# EAGLE design chamberbiasa (EAGLE 7.6.0)
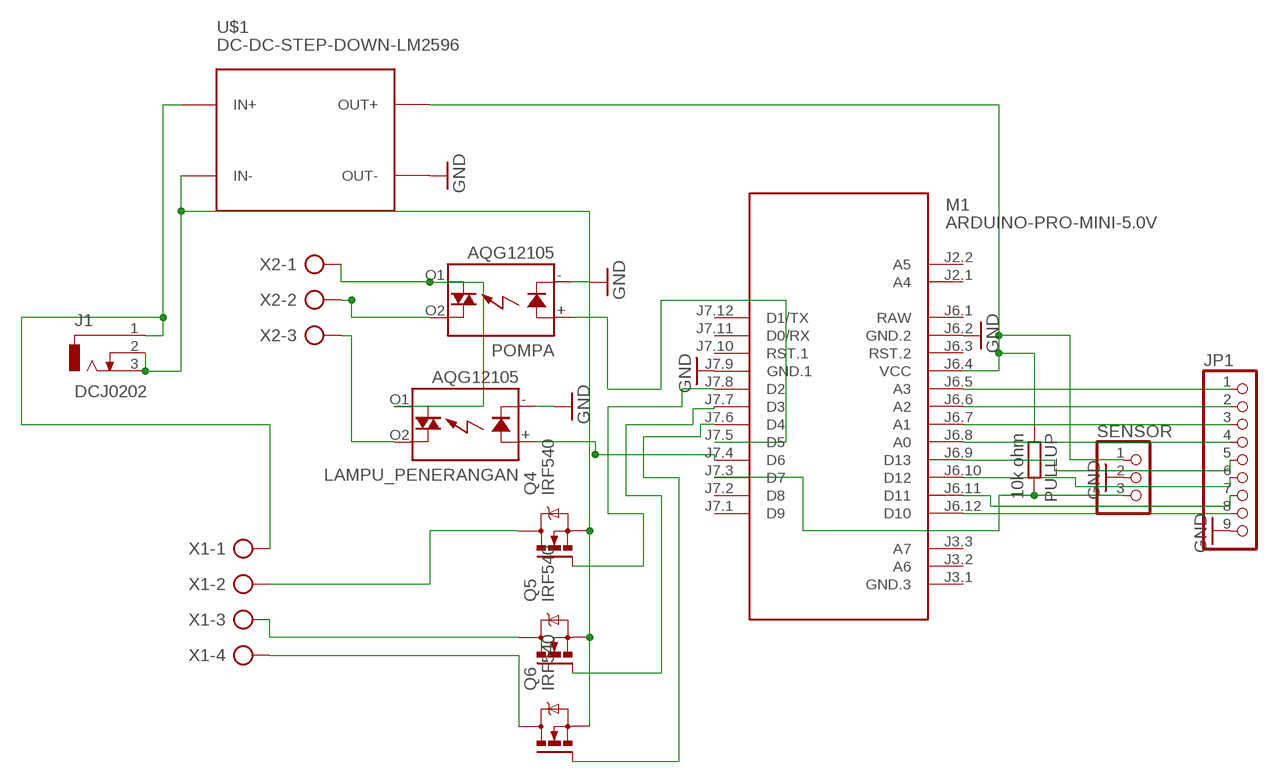
[diagram p0: schematic, sheet 1]

## Parts
J1  DCJ0202  [DCJ0202]
JP1  PINHD-1X9  [1X09]
LAMPU_PENERANGAN  AQG12105  [AQG]
M1  ARDUINO-PRO-MINI-5.0V  [ARDUINO-PRO-MINI]
POMPA  AQG12105  [AQG]
PULLUP  10k ohm  R-EU_0204/7  [0204/7]
Q4  IRF540  [TO220BV]
Q5  IRF540  [TO220BV]
Q6  IRF540  [TO220BV]
SENSOR  PINHD-1X3  [1X03]
U$1  DC-DC-STEP-DOWN-LM2596  [DC-DC-STEP-DOWN-LM2596]
X1  AK300/4  [AK300/4]
X2  AK300/3  [AK300/3]

## Nets
5V: M1.J6.4(VCC) PULLUP.1 SENSOR.1 U$1.OUT+
-12V: J1.2 J1.3 Q4.S Q5.S Q6.S U$1.IN-
GND: JP1.9 LAMPU_PENERANGAN.-(K) M1.J6.2(GND.2) M1.J7.9(GND.1) POMPA.-(K) SENSOR.2 U$1.OUT-
N$1: LAMPU_PENERANGAN.+(A) M1.J7.4(D6)
N$2: M1.J7.8(D2) Q4.G
N$3: M1.J7.5(D5) POMPA.+(A)
N$4: M1.J7.7(D3) Q5.G
N$5: M1.J7.6(D4) Q6.G
N$6: Q4.D X1.2
N$7: Q5.D X1.3
N$8: Q6.D X1.4
N$10: J1.1 U$1.IN+ X1.1
N$11: POMPA.O2(DS1) X2.2
N$12: LAMPU_PENERANGAN.O1(DS2) POMPA.O1(DS2) X2.1
N$13: LAMPU_PENERANGAN.O2(DS1) X2.3
N$14: JP1.1 M1.J6.5(A3)
N$15: M1.J7.3(D7) PULLUP.2 SENSOR.3
N$16: JP1.2 M1.J6.6(A2)
N$17: JP1.3 M1.J6.7(A1)
N$18: JP1.4 M1.J6.8(A0)
N$19: JP1.5 M1.J6.9(D13)
N$20: JP1.6 M1.J6.10(D12)
N$21: JP1.7 M1.J6.11(D11)
N$22: JP1.8 M1.J6.12(D10)
Unconnected: M1.J2.1(A4) M1.J2.2(A5) M1.J3.1(GND.3) M1.J3.2(A6) M1.J3.3(A7) M1.J6.3(RST.2) M1.J7.1(D9) M1.J7.2(D8) M1.J7.10(RST.1) M1.J7.11(D0/RX) M1.J7.12(D1/TX)

## Power pins joined to a net without a drawn wire
RAW: M1.J6.1(RAW)

## Library data of the parts
J1 = con-jack:DCJ0202: DC POWER JACK Source: DCJ0202.pdf; OC_FARNELL: unknown; OC_NEWARK: unknown
JP1 = pinhead:PINHD-1X9: PIN HEADER
LAMPU_PENERANGAN POMPA = relay:AQG*: SOLID STATE RELAY NAiS Zero-cross, Non zero-cross Source: http://www.mew-europe.com/.. en_ds_61611_0000.pdf; MF: AROMAT/ MATSUSHITA; MPN: AQG12105; OC_FARNELL: unknown; OC_NEWARK: 20J4759
M1 = diy-modules:ARDUINO-PRO-MINI-*: Arduino Pro Mini and compatible devices More details available here: https://www.arduino.cc/en/Main/ArduinoBoardProMini Click here to find device on ebay.com <http://www.ebay.com/sch/arduino+pro+mini>
PULLUP = rcl:R-EU_: RESISTOR, European symbol
Q4-Q6 = transistor-power:IRF540: HEXFET Power MOSFET
SENSOR = pinhead:PINHD-1X3: PIN HEADER
U$1 = diy-modules:DC-DC-STEP-DOWN-LM2596: DC/DC Step-Down Regulator based on LM2596-ADJ chip LM2596 datasheet available here: http://www.ti.com/lit/ds/symlink/lm2596.pdf Click here to find device on ebay.com <http://www.ebay.com/sch/lm2596+power+regulator>
X1 = con-ptr500:AK300/4: CONNECTOR; OC_FARNELL: unknown; OC_NEWARK: unknown
X2 = con-ptr500:AK300/3: CONNECTOR; OC_FARNELL: unknown; OC_NEWARK: unknown

## Board
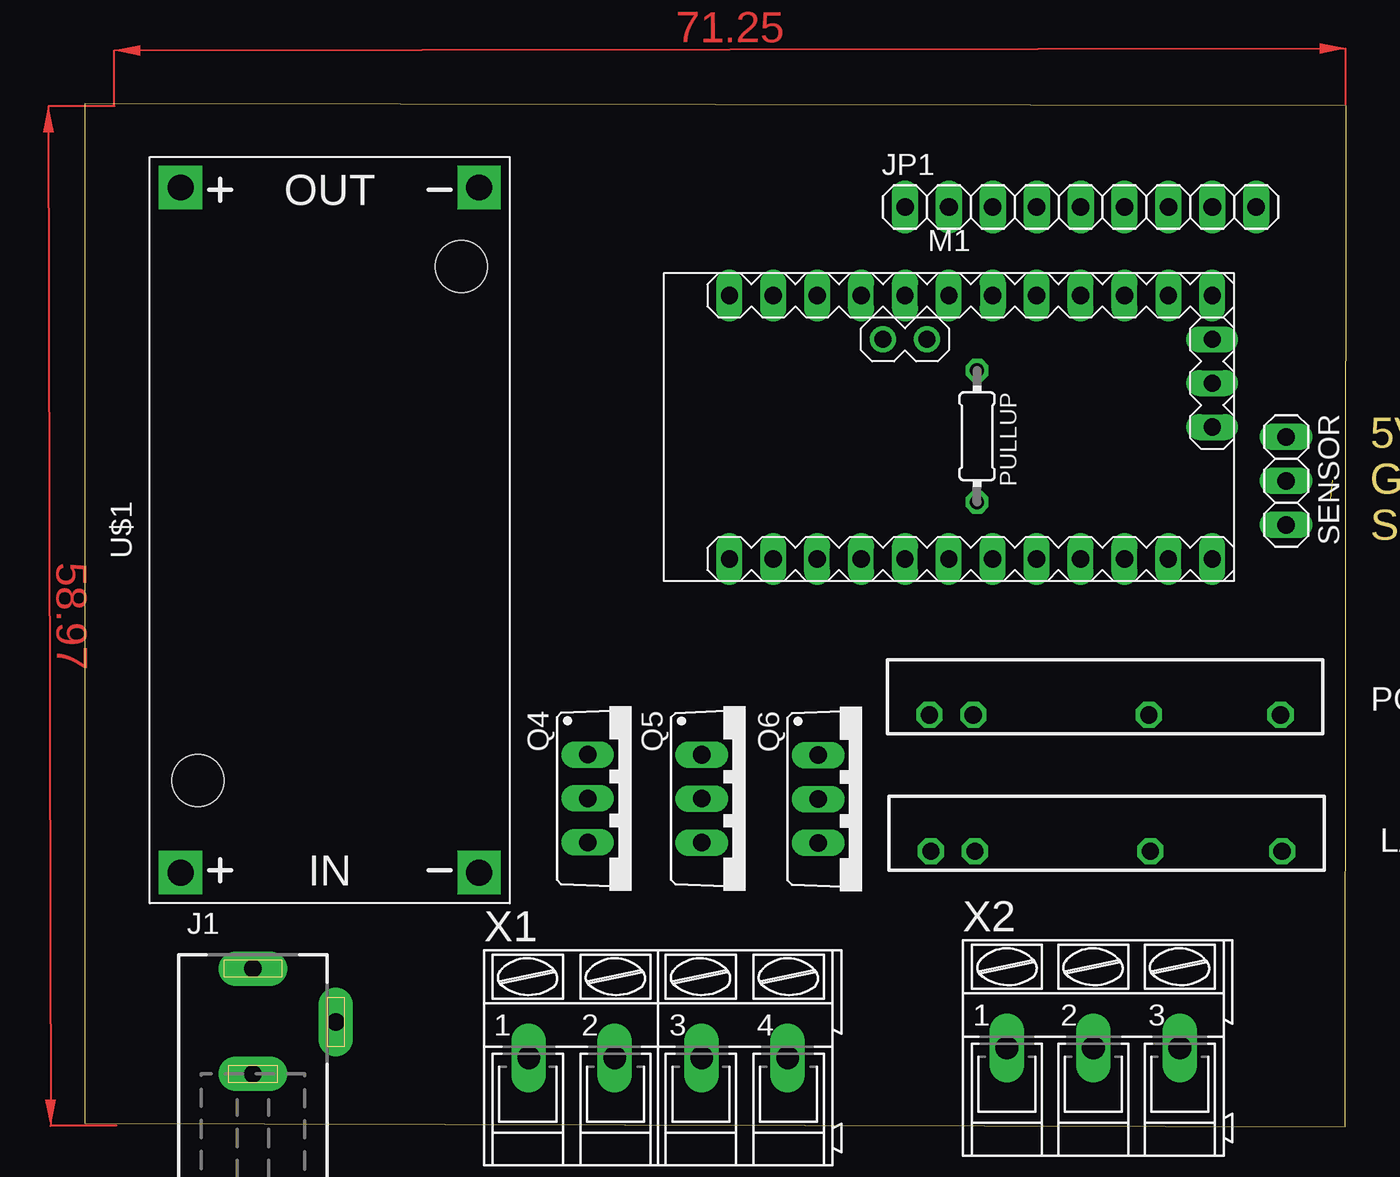
[diagram p1: board, top side]
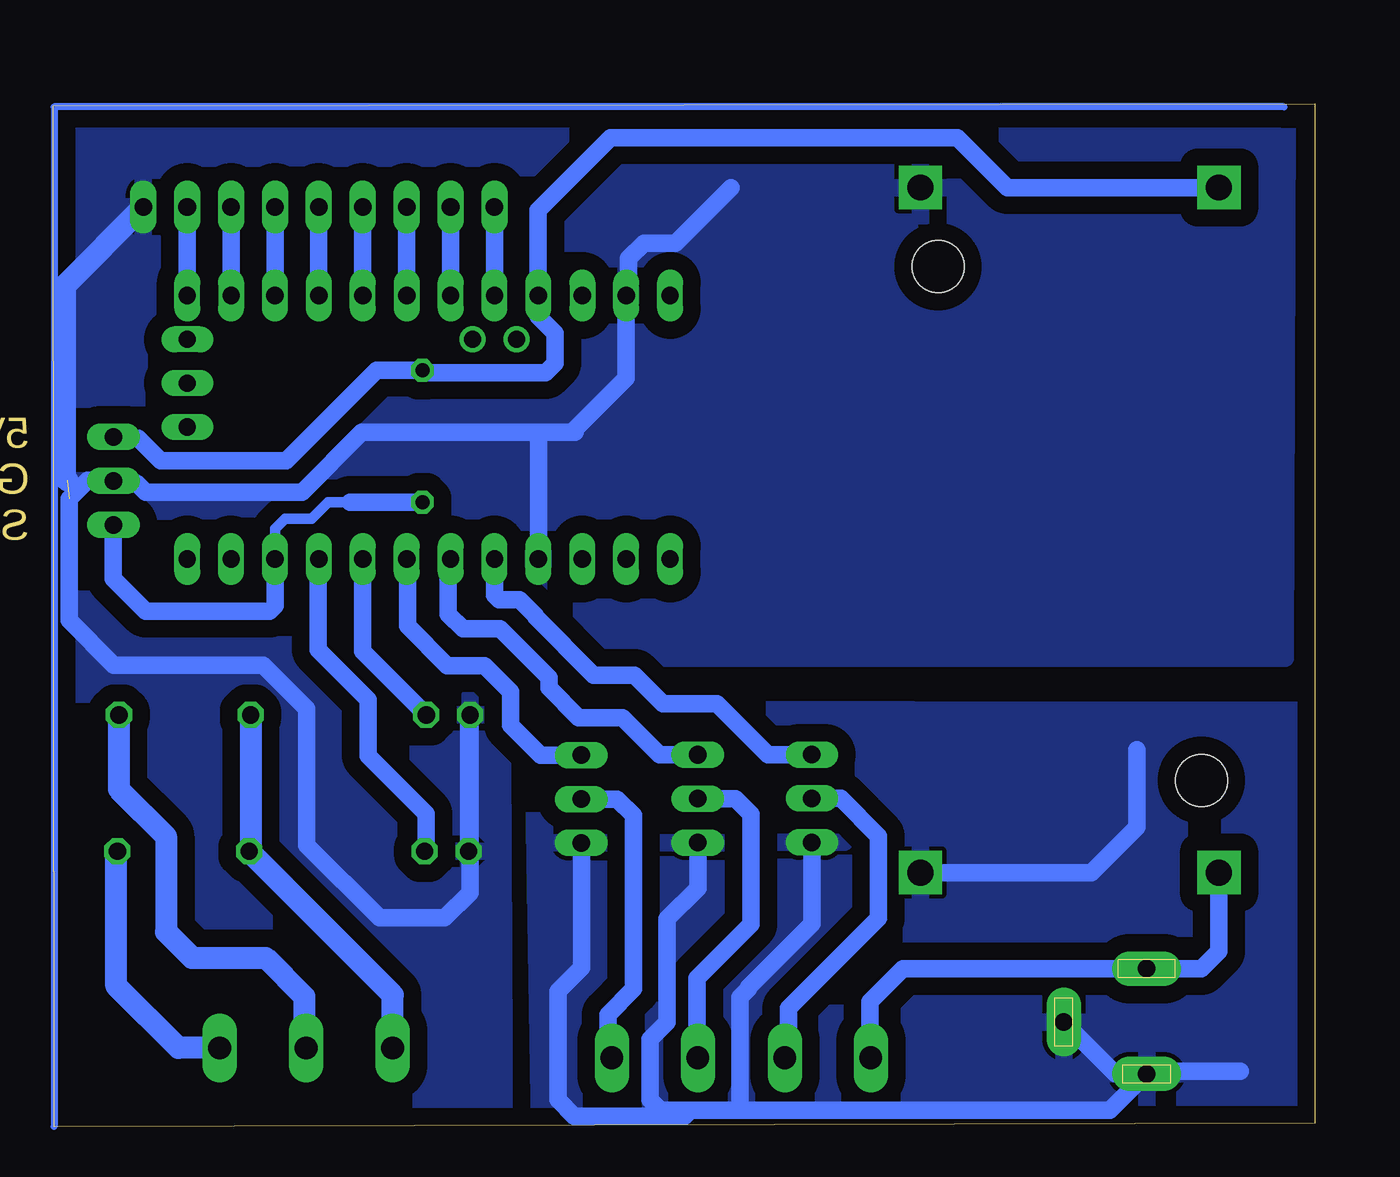
[diagram p2: board, bottom side, seen from below]

Size 72.98 x 59.19 mm. Coordinates in mm from the lower left corner, seen from the top.
Outline: 0,0.21 72.93,0 72.98,59.06 0,59.19 0,0.21
Copper layers (1*16): Top 0.035mm / dielectric 1.5mm / Bottom 0.035mm
Design rules "default": minimum track width 10mil, minimum drill 24mil, track to track 8mil, track to pad 8mil, pad to pad 8mil, via to via 8mil, smd to smd 8mil, copper to edge 40mil, drill to drill 8mil, minimum pad ring 10mil, minimum via ring 8mil, stop-mask expansion 4mil, vias tented up to drill 0mil, thermal gap 10mil

### Footprints (pad centres in the part's own frame; a part is rotated, then mirrored left to right if it is on the bottom)
DCJ0202 = drill 1 pad 2 long: 1 0,3.1; 2 4.8,0; 3 0,-3
1X09 = drill 1.016 long: 1 -10.16,0; 2 -7.62,0; 3 -5.08,0; 4 -2.54,0; 5 0,0; 6 2.54,0; 7 5.08,0; 8 7.62,0; 9 10.16,0
AQG = drill 1 octagon: + -7.62,0; - -10.16,0; O1 2.54,0; O2 10.16,0
ARDUINO-PRO-MINI = drill 1: J2.1 -1.27,5.08; J2.2 -3.81,5.08 | drill 1 long: J3.1 15.24,0; J3.2 15.24,2.54; J3.3 15.24,5.08; J6.1 -12.7,7.62; J6.2 -10.16,7.62; J6.3 -7.62,7.62; J6.4 -5.08,7.62; J6.5 -2.54,7.62; J6.6 0,7.62; J6.7 2.54,7.62; J6.8 5.08,7.62; J6.9 7.62,7.62; J6.10 10.16,7.62; J6.11 12.7,7.62; J6.12 15.24,7.62; J7.1 15.24,-7.62; J7.2 12.7,-7.62; J7.3 10.16,-7.62; J7.4 7.62,-7.62; J7.5 5.08,-7.62; J7.6 2.54,-7.62; J7.7 0,-7.62; J7.8 -2.54,-7.62; J7.9 -5.08,-7.62; J7.10 -7.62,-7.62; J7.11 -10.16,-7.62; J7.12 -12.7,-7.62
0204/7 = drill 0.813 octagon: 1 -3.81,0; 2 3.81,0
TO220BV = drill 1.016 long: D 0,-2.54; G -2.54,-2.54; S 2.54,-2.54
1X03 = drill 1.016 long: 1 -2.54,0; 2 0,0; 3 2.54,0
DC-DC-STEP-DOWN-LM2596 = drill 1.5 pad 2.5 square: IN+ -19.812,8.636; IN- -19.812,-8.636; OUT+ 19.812,8.636; OUT- 19.812,-8.636 | hole 3: -14.478,7.62; 15.24,-7.62
AK300/4 = drill 1.321 long: 1 -7.493,0; 2 -2.515,0; 3 2.515,0; 4 7.493,0
AK300/3 = drill 1.321 long: 1 -5.004,0; 2 0,0; 3 5.004,0

### Placement (x,y rotation side)
J1  9.72,6.06 0 top
JP1  57.62,53.2 0 top
LAMPU_PENERANGAN  59.11,15.93 0 top
M1  49.99,40.47 0 top
POMPA  59.02,23.83 0 top
PULLUP  51.62,39.94 270 top
Q4  31.63,18.99 270 top
Q5  38.23,18.98 270 top
Q6  44.97,18.96 270 top
SENSOR  69.5,37.36 270 top
U$1  14.17,34.52 90 top
X1  33.17,3.99 0 top
X2  58.35,4.56 0 top

### Tracks (layer width: path | path; a pad name or v marks a point on that pad's centre or on a via)
5V
  Bottom 1.016: U$1.OUT+ 17.77,54.33 20.65,57.22 40.73,57.22 44.93,53.02 44.93,48.11 | 44.91,49.09 M1.J6.4 44.93,48.11 | 44.93,48.11 44.93,46.88 43.95,45.9 43.95,44.18 44.5,43.63 51.5,43.63 PULLUP.1 54.27,43.75 59.51,38.52 66.78,38.52 68.08,39.82 69.42,39.82 SENSOR.1
-12V
  Bottom 1.016: J1.3 11.52,3.05 J1.2 | U$1.IN- 12.9,14.71 10.29,17.32 10.29,21.8 | 4.31,3.2 9.57,3.2 J1.3 | Q4.S 29.09,11.74 32.76,8.06 32.76,7.98 33.26,7.48 33.26,0.96 | Q5.S 35.69,13.81 37.47,12.03 37.47,6.04 38.44,5.07 38.44,1.56 37.84,0.96 36.12,0.96 | 36.12,0.96 33.26,0.96 | 33.26,0.96 11.85,0.96 9.75,3.05 J1.3 | Q6.S 42.43,9.19 43.77,7.85 43.77,1.56 42.84,0.62 36.45,0.62 36.12,0.96
  pour Bottom (isolate 1.016): 45.24,24.16 44.85,-0.15 0.07,-0.59 1.1,24.09
GND  (1 unrouted)
  Bottom 1.016: 33.75,54.33 36.97,51.12 38.8,51.12 39.69,50.23 39.69,48.23 M1.J6.2 39.83,43.3 42.96,40.17 | 45.08,40.17 55.13,40.17 58.6,36.7 67.65,36.7 68.16,37.22 69.37,37.22 SENSOR.2 | 45.08,40.17 42.96,40.17 | 42.96,40.17 42.8,40.17 | 69.39,37.24 SENSOR.2 | SENSOR.2 69.47,37.4 71,37.4 72.07,36.33 72.07,29.3 69.48,26.7 60.83,26.7 58.31,24.19 58.31,16.3 54.1,12.08 50.34,12.08 48.86,13.55 POMPA.- 48.95,23.74 LAMPU_PENERANGAN.- | M1.J7.9 44.91,40 45.08,40.17
  Bottom 1.27: 72.17,37.4 72.3,37.52 72.3,48.68 JP1.9
  pour Bottom (isolate 1.016): 1.57,58.78 73.33,58.78 73.33,-1.1 46.88,-1.1 47.01,27.09 1.7,27.09
N$1
  Bottom 1.016: LAMPU_PENERANGAN.+ 51.42,16.01 51.42,18.12 54.77,21.47 54.77,24.7 57.65,27.58 57.65,32.81 M1.J7.4
N$2
  Bottom 1.016: Q4.G 31.64,21.53 34.59,24.48 37.7,24.48 39.34,26.12 41.72,26.12 45.09,29.49 45.09,29.56 46.01,30.48 47.18,30.48 47.44,30.75 47.44,32.84 M1.J7.8
N$3
  Bottom 1.016: M1.J7.5 55.07,27.5 POMPA.+
N$4
  Bottom 1.016: Q5.G 37.9,21.52 40.03,23.66 42.58,23.66 44.31,25.38 44.31,25.99 47.12,28.8 49.28,28.8 50.14,29.66 50.14,32.7 M1.J7.7
N$5
  Bottom 1.016: Q6.G 44.79,21.5 46.51,23.22 46.51,25.17 48.02,26.68 50.18,26.68 52.47,28.97 52.47,32.79 M1.J7.6
N$6
  Bottom 1.016: Q4.D 27.4,18.99 25.22,16.82 25.22,12.07 30.44,6.86 30.44,4.21 X1.2
N$7
  Bottom 1.016: Q5.D 33.5,18.98 32.6,18.08 32.6,11.72 35.74,8.59 35.74,4.04 X1.3
N$8
  Bottom 1.016: Q6.D 40.35,18.96 39.4,18.01 39.4,7.99 40.9,6.49 40.9,4.22 X1.4
N$10
  Bottom 1.016: X1.1 25.73,4.04 25.73,7.24 23.82,9.15 J1.1 9.71,9.14 6.55,9.14 5.53,10.16 U$1.IN+
N$11
  Bottom 1.27: POMPA.O2 69.18,19.53 66.45,16.8 66.45,11.27 64.96,9.78 60.7,9.78 58.46,7.54 58.46,4.67 X2.2
N$12
  Bottom 1.27: X2.1 53.35,7.63 LAMPU_PENERANGAN.O1 61.56,16.02 POMPA.O1
N$13
  Bottom 1.27: X2.3 65.75,4.56 69.34,8.14 69.34,15.87 LAMPU_PENERANGAN.O2
N$14
  Bottom 1.016: JP1.1 M1.J6.5
N$15
  Bottom 0.61: M1.J7.3 60.15,34.58 59.55,35.18 58.03,35.18 57.08,36.13 55.8,36.13
  Bottom 1.016: PULLUP.2 55.8,36.13 | SENSOR.3 69.5,31.71 67.63,29.84 60.45,29.84 60.15,30.14 M1.J7.3
N$16
  Bottom 1.016: JP1.2 M1.J6.6
N$17
  Bottom 1.016: JP1.3 M1.J6.7
N$18
  Bottom 1.016: JP1.4 M1.J6.8
N$19
  Bottom 1.016: JP1.5 M1.J6.9
N$20
  Bottom 1.016: JP1.6 M1.J6.10
N$21
  Bottom 1.016: JP1.7 M1.J6.11
N$22
  Bottom 1.016: JP1.8 M1.J6.12
N$23
  Bottom 0.406: 1.78,59 72.94,59 72.94,0
(copper drawn outside any net)
  shapes: Top area x2

### Text on the board
Dimension: 5V / GND / SIGNAL | +12v OUTPUT / / MERAH / / HIJAU / / BUZZER / / / / / LINE IN / / LAMPU TL / / POMPA